# Altium project f1_hw_tst.PrjPcb
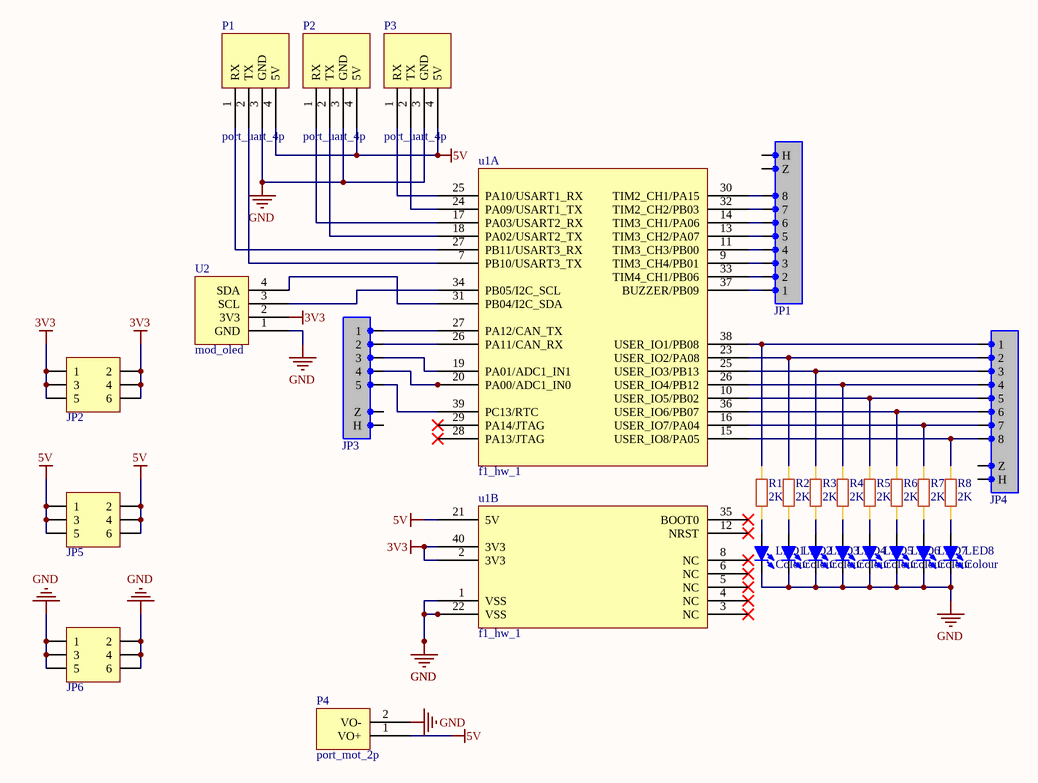
[diagram p0: f1_hw_tst.SchDoc]
1 sheet, 28 parts. Net scope: global (net labels, ports and power ports of the same name join across sheets).
Board file: f1_hw_tst.PcbDoc

## Sheet f1_hw_tst.SchDoc
size A4; SheetNumber: 1; SheetTotal: 1

### Parts
JP1  HDR-1X8  [HDR2.54-LI-8P]  (value not drawn)
JP2  Header3X2  [HDR2.54-LI-2x3P]  (value not drawn)
JP3  HDR-1X5  [HDR2.54-LI-5P]  (value not drawn)
JP4  HDR-1X8  [HDR2.54-LI-8P]  (value not drawn)
JP5  Header3X2  [HDR2.54-LI-2x3P]  (value not drawn)
JP6  Header3X2  [HDR2.54-LI-2x3P]  (value not drawn)
LED1  Colour  [LED 0603R]
LED2  Colour  [LED 0603R]
LED3  Colour  [LED 0603R]
LED4  Colour  [LED 0603R]
LED5  Colour  [LED 0603R]
LED6  Colour  [LED 0603R]
LED7  Colour  [LED 0603R]
LED8  Colour  [LED 0603R]
P1  port_uart_4p  [XH2.54_4P]
P2  port_uart_4p  [XH2.54_4P]
P3  port_uart_4p  [XH2.54_4P]
P4  port_mot_2p  [XH2.54_2P]
R1  2K  [R 0603_L]
R2  2K  [R 0603_L]
R3  2K  [R 0603_L]
R4  2K  [R 0603_L]
R5  2K  [R 0603_L]
R6  2K  [R 0603_L]
R7  2K  [R 0603_L]
R8  2K  [R 0603_L]
u1  f1_hw_1  [f1_hw_1]  (parts A,B of 2)
U2  mod_oled  [mod_oled]

### Nets
3V3: JP2.1 JP2.2 JP2.3 JP2.4 JP2.5 JP2.6 u1.2(3V3) u1.40(3V3) U2.2(3V3)
5V: JP5.1 JP5.2 JP5.3 JP5.4 JP5.5 JP5.6 P1.4(5V) P2.4(5V) P3.4(5V) P4.1(VO+) u1.21(5V)
GND: JP6.1 JP6.2 JP6.3 JP6.4 JP6.5 JP6.6 LED1.2(K) LED2.2(K) LED3.2(K) LED4.2(K) LED5.2(K) LED6.2(K) LED7.2(K) LED8.2(K) P1.3(GND) P2.3(GND) P3.3(GND) P4.2(VO-) u1.1(VSS) u1.22(VSS) U2.1(GND)
NetJP1_1: JP1.1 u1.37(BUZZER/PB09)
NetJP1_2: JP1.2 u1.33(TIM4_CH1/PB06)
NetJP1_3: JP1.3 u1.9(TIM3_CH4/PB01)
NetJP1_4: JP1.4 u1.11(TIM3_CH3/PB00)
NetJP1_5: JP1.5 u1.13(TIM3_CH2/PA07)
NetJP1_6: JP1.6 u1.14(TIM3_CH1/PA06)
NetJP1_7: JP1.7 u1.32(TIM2_CH2/PB03)
NetJP1_8: JP1.8 u1.30(TIM2_CH1/PA15)
NetJP3_1: JP3.1 u1.27(PA12/CAN_TX)
NetJP3_2: JP3.2 u1.26(PA11/CAN_RX)
NetJP3_3: JP3.3 u1.19(PA01/ADC1_IN1)
NetJP3_4: JP3.4 u1.20(PA00/ADC1_IN0)
NetJP3_5: JP3.5 u1.39(PC13/RTC)
NetJP4_1: JP4.1 R1.1 u1.38(USER_IO1/PB08)
NetJP4_2: JP4.2 R2.1 u1.23(USER_IO2/PA08)
NetJP4_3: JP4.3 R3.1 u1.25(USER_IO3/PB13)
NetJP4_4: JP4.4 R4.1 u1.26(USER_IO4/PB12)
NetJP4_5: JP4.5 R5.1 u1.10(USER_IO5/PB02)
NetJP4_6: JP4.6 R6.1 u1.36(USER_IO6/PB07)
NetJP4_7: JP4.7 R7.1 u1.16(USER_IO7/PA04)
NetJP4_8: JP4.8 R8.1 u1.15(USER_IO8/PA05)
NetLED1_1: LED1.1(A) R1.2
NetLED2_1: LED2.1(A) R2.2
NetLED3_1: LED3.1(A) R3.2
NetLED4_1: LED4.1(A) R4.2
NetLED5_1: LED5.1(A) R5.2
NetLED6_1: LED6.1(A) R6.2
NetLED7_1: LED7.1(A) R7.2
NetLED8_1: LED8.1(A) R8.2
NetP1_1: P1.1(RX) u1.27(PB11/USART3_RX)
NetP1_2: P1.2(TX) u1.7(PB10/USART3_TX)
NetP2_1: P2.1(RX) u1.17(PA03/USART2_RX)
NetP2_2: P2.2(TX) u1.18(PA02/USART2_TX)
NetP3_1: P3.1(RX) u1.25(PA10/USART1_RX)
NetP3_2: P3.2(TX) u1.24(PA09/USART1_TX)
Netu1_31: u1.31(PB04/I2C_SDA) U2.4(SDA)
Netu1_34: u1.34(PB05/I2C_SCL) U2.3(SCL)

Not connected (* = marked no-connect by the designer): JP1 0(Z) 100(H); JP3 0(Z) 100(H); JP4 0(Z) 100(H); u1 3(NC)* 4(NC)* 5(NC)* 6(NC)* 8(NC)* 12(NRST)* 28(PA13/JTAG)* 29(PA14/JTAG)* 35(BOOT0)*

### Library data of the parts
JP1 JP4 = Header 8: 8P接插件; 版权归属: 源创客; BOM名称: 8P接插件; 学习资源: www.ooocke.com
JP2 JP5 JP6 = Header 3X2: 3*2P接插件; 版权归属: 源创客; BOM名称: 3*2P接插件; 学习资源: www.ooocke.com
JP3 = Header 5: 5P接插件; 版权归属: 源创客; BOM名称: 5P接插件; 学习资源: www.ooocke.com
LED1-LED8 = LED-SMD: 贴片LED; 版权归属: 源创客; BOM名称: 贴片LED; 学习资源: www.ooocke.com
P1-P3 = port_uart_4p: 串口接口/SPP蓝牙模块 / XH2.54弯排针4p/4p排母
P4 = port_mot_2p: 开环直流电机接口 / XH2.54弯排针2p
R1-R8 = 电阻: 贴片电阻1%精度
u1 = f1_hw_1: F103C8T6最小系统_1
U2 = mod_oled: oled模块 / 4p排母